# Altium schematic sheet STM32_AUX.SchDoc
size A4; SheetNumber: 8; SheetTotal: 10
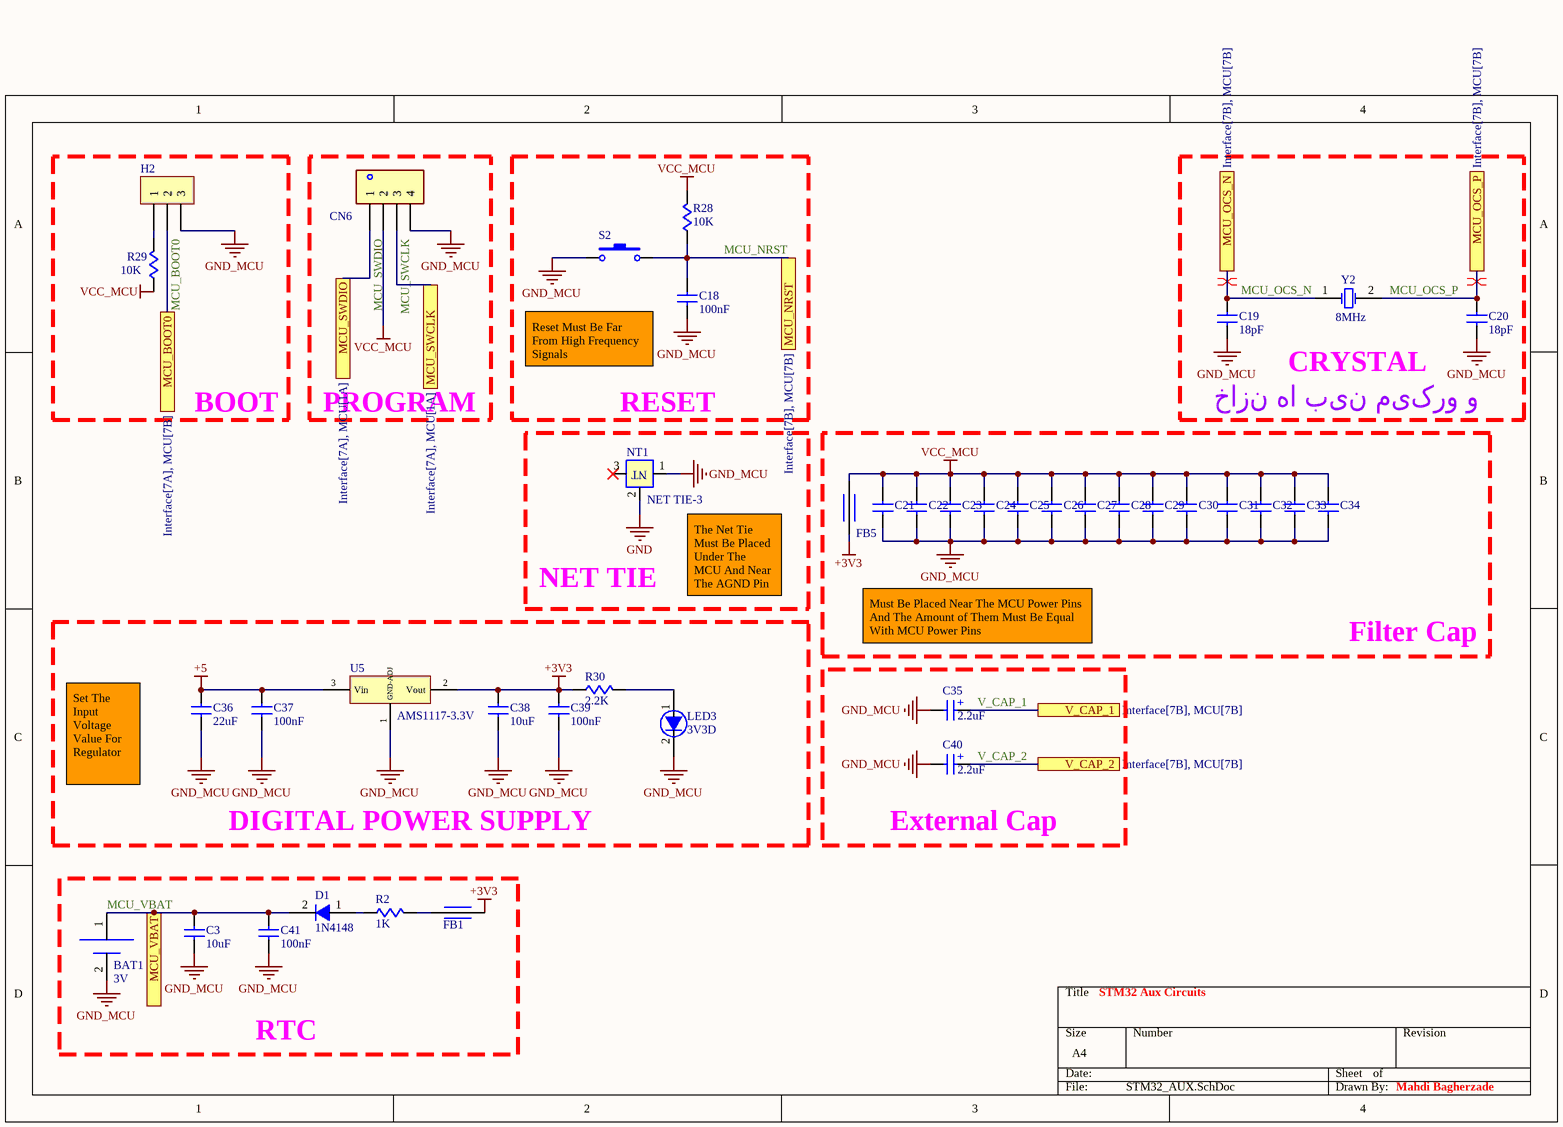
[diagram p0: STM32_AUX.SchDoc]

## Parts
BAT1  Voltage: 3V  [BAT-HOLDER-SMD-3V]  (hidden comment: Bat Holder 2016-SMD)
C3  value 10uF  [C-0805]  (hidden comment: CAP Cer 10uF-50V-X7R-SMD)
C18  value 100nF  [C-0805]  (hidden comment: CAP Cer 100nF-50V-X7R-SMD)
C19  value 18pF  [C-0805]  (hidden comment: CAP Cer 18pF-50V-X7R-SMD)
C20  value 18pF  [C-0805]  (hidden comment: CAP Cer 18pF-50V-X7R-SMD)
C21  CAP Cer 100nF-50V-X7R-SMD  [C-0805]  (value not drawn)
C22  CAP Cer 100nF-50V-X7R-SMD  [C-0805]  (value not drawn)
C23  CAP Cer 100nF-50V-X7R-SMD  [C-0805]  (value not drawn)
C24  CAP Cer 100nF-50V-X7R-SMD  [C-0805]  (value not drawn)
C25  CAP Cer 100nF-50V-X7R-SMD  [C-0805]  (value not drawn)
C26  CAP Cer 100nF-50V-X7R-SMD  [C-0805]  (value not drawn)
C27  CAP Cer 100nF-50V-X7R-SMD  [C-0805]  (value not drawn)
C28  CAP Cer 100nF-50V-X7R-SMD  [C-0805]  (value not drawn)
C29  CAP Cer 100nF-50V-X7R-SMD  [C-0805]  (value not drawn)
C30  CAP Cer 100nF-50V-X7R-SMD  [C-0805]  (value not drawn)
C31  CAP Cer 100nF-50V-X7R-SMD  [C-0805]  (value not drawn)
C32  CAP Cer 100nF-50V-X7R-SMD  [C-0805]  (value not drawn)
C33  CAP Cer 100nF-50V-X7R-SMD  [C-0805]  (value not drawn)
C34  CAP Cer 100nF-50V-X7R-SMD  [C-0805]  (value not drawn)
C35  value 2.2uF  [TAN-A]
C36  value 22uF  [C-0805]  (hidden comment: CAP Cer 22uF-50V-X7R-SMD)
C37  value 100nF  [C-0805]  (hidden comment: CAP Cer 100nF-50V-X7R-SMD)
C38  value 10uF  [C-0805]  (hidden comment: CAP Cer 10uF-50V-X7R-SMD)
C39  value 100nF  [C-0805]  (hidden comment: CAP Cer 100nF-50V-X7R-SMD)
C40  value 2.2uF  [TAN-A]
C41  value 100nF  [C-0805]  (hidden comment: CAP Cer 100nF-50V-X7R-SMD)
CN6  Connector XH/VH/TE-Straight/Right-THD/SMD-?mm  [XH-4]  (value not drawn)
D1  Code: 1N4148  [SOD80]  (hidden comment: Diode 1N4148-SMD)
FB1  Ferrite Bead SMD  [FB-0805]  (value not drawn)
FB5  FERRITE BEAD  [FB-0805]  (value not drawn)
H2  BOOT  [H-3pin-M-S]  (value not drawn)
LED3  3V3D  [LED-1206-R]
NT1  NET TIE-3  [NET TIE-3]  (net tie, no BOM)
R2  value 1K  [R-0805]  (hidden comment: RES 1K-5%-1/8W-SMD)
R28  value 10K  [R-0805]
R29  value 10K  [R-0805]
R30  value 2.2K  [R-0805]
S2  RESET  [SW-SMD-2pin-3x6]  (value not drawn)
U5  AMS1117-3.3V  [SOT223]
Y2  value 8MHz  [CRYSTAL-SMD]

## Blocks framed on the sheet
BOOT: H2 R29
PROGRAM: CN6
RESET: C18 R28 S2
CRYSTAL: C19 C20 Y2
Filter Cap: C21-C34 FB5
DIGITAL POWER SUPPLY: C36-C39 LED3 R30 U5
External Cap: C35 C40
RTC: BAT1 C3 C41 D1 FB1 R2

## Ports
MCU_BOOT0 (see Interface[7A], MCU[7B]), MCU_NRST (see Interface[7B], MCU[7B]), MCU_OCS_N (see Interface[7B], MCU[7B]), MCU_OCS_P (see Interface[7B], MCU[7B]), MCU_SWCLK (see Interface[7A], MCU[1A]), MCU_SWDIO (see Interface[7A], MCU[1A]), MCU_VBAT, V_CAP_1 (see Interface[7B], MCU[7B]), V_CAP_2 (see Interface[7B], MCU[7B])

## Nets
+3V3: C38.1 C39.1 FB1.1 FB5.1 R30.1 U5.2(Vout)
+5: C36.1 C37.1 U5.3(Vin)
GND: NT1.2
GND_MCU: BAT1.2(-) C3.1 C18.2 C19.2 C20.2 C21.2 C22.2 C23.2 C24.2 C25.2 C26.2 C27.2 C28.2 C29.2 C30.2 C31.2 C32.2 C33.2 C34.2 C35.2 C36.2 C37.2 C38.2 C39.2 C40.2 C41.1 CN6.4 H2.3 LED3.2(C) NT1.1 S2.1 U5.1(GND-ADJ)
VCC_MCU: C21.1 C22.1 C23.1 C24.1 C25.1 C26.1 C27.1 C28.1 C29.1 C30.1 C31.1 C32.1 C33.1 C34.1 CN6.2 FB5.2 R28.2 R29.1
MCU_BOOT0: H2.2 ; port MCU_BOOT0
MCU_NRST: C18.1 R28.1 S2.2 ; port MCU_NRST
MCU_OCS_N: C19.1 Y2.1(OSC1) ; port MCU_OCS_N
MCU_OCS_P: C20.1 Y2.2(OSC2) ; port MCU_OCS_P
MCU_SWCLK: CN6.3 ; port MCU_SWCLK
MCU_SWDIO: CN6.1 ; port MCU_SWDIO
MCU_VBAT: BAT1.1(+) C3.2 C41.2 D1.2(C) ; port MCU_VBAT
V_CAP_1: C35.1 ; port V_CAP_1
V_CAP_2: C40.1 ; port V_CAP_2
NetD1_1: D1.1(A) R2.1
NetFB1_2: FB1.2 R2.2
NetH2_1: H2.1 R29.2
NetLED3_1: LED3.1(A) R30.2

Not connected (* = marked no-connect by the designer): NT1 3*

## Layout directives
differential pair: MCU_OCS_N, MCU_OCS_P

## Notes on the sheet
- Reset Must Be Far From High Frequency Signals
- خازن ها بین میکرو و کریستال قرار بگیرند
- NET TIE
- The Net Tie Must Be Placed Under The MCU And Near The AGND Pin
- Must Be Placed Near The MCU Power Pins And The Amount of Them Must Be Equal With MCU Power Pins
- Set The Input Voltage Value For Regulator
- STM32 Aux Circuits
- Mahdi Bagherzade
- (in symbol CAP-TAN) +
- (in symbol NET TIE-3) NT

## Library data of the parts
BAT1 = BATTERY HOLDER: BATTERY; Phone Number: 0915 8700 314; Publisher: Mahdi Bagherzadeh; ComponentLink1Description: Linkedin; ComponentLink1URL: https://ir.linkedin.com/in/mahdi-bagherzade; Published Date: 9-15-2024; Size: 2016; Type: SMD
C3 C18-C20 C36-C39 C41 = CAP-CER: CAPACITOR; Phone Number: 0915 8700 314; Voltage: 50V; Tolerance: X7R; Type: SMD; Publisher: Mahdi Bagherzadeh; ComponentLink1Description: Linkedin; ComponentLink1URL: https://ir.linkedin.com/in/mahdi-bagherzade; Published Date: 9-15-2024
C21-C34 = CAP-CER: CAPACITOR; Phone Number: 0915 8700 314; Voltage: 50V; Tolerance: X7R; Type: SMD; Value: 100nF; Publisher: Mahdi Bagherzadeh; ComponentLink1Description: Linkedin; ComponentLink1URL: https://ir.linkedin.com/in/mahdi-bagherzade; Published Date: 9-15-2024
C35 C40 = CAP-TAN: CAPACITOR; Phone Number: 0915 8700 314; Voltage: 16V; Publisher: Mahdi Bagherzadeh; ComponentLink1Description: Linkedin; ComponentLink1URL: https://ir.linkedin.com/in/mahdi-bagherzade; Published Date: 9-15-2024; Power: -; Size: A; Tolerance: -
CN6 = CN-4pin: CONNECTOR; Phone Number: 0915 8700 314; Publisher: Mahdi Bagherzadeh; ComponentLink1Description: Linkedin; ComponentLink1URL: https://ir.linkedin.com/in/mahdi-bagherzade; Published Date: 9-15-2024; Size: ?mm; Type: Straight/Right-THD/SMD; Value: XH/VH/TE
D1 = DIODE: Phone Number: 0915 8700 314; Type: SMD; Publisher: Mahdi Bagherzadeh; ComponentLink1Description: Linkedin; ComponentLink1URL: https://ir.linkedin.com/in/mahdi-bagherzade; Published Date: 9-15-2024
FB1 FB5 = FERRITE BEAD: INDUCATOR; Phone Number: 0915 8700 314; Publisher: Mahdi Bagherzadeh; ComponentLink1Description: Linkedin; ComponentLink1URL: https://ir.linkedin.com/in/mahdi-bagherzade; Published Date: 9-15-2024
  FB1: Type: SMD
H2 = HEADER-3pin: HEADER; Phone Number: 0915 8700 314; Publisher: Mahdi Bagherzadeh; ComponentLink1Description: Linkedin; ComponentLink1URL: https://ir.linkedin.com/in/mahdi-bagherzade; Published Date: 9-15-2024; Type: MALE-STRAIGHT
LED3 = LED: Phone Number: 0915 8700 314; Color: RED; Publisher: Mahdi Bagherzadeh; ComponentLink1Description: Linkedin; ComponentLink1URL: https://ir.linkedin.com/in/mahdi-bagherzade; Published Date: 9-15-2024; Size: 0805
NT1 = NET TIE-3: Phone Number: 0915 8700 314; Publisher: Mahdi Bagherzadeh; ComponentLink1Description: Linkedin; ComponentLink1URL: https://ir.linkedin.com/in/mahdi-bagherzade; Published Date: 9-15-2024
R2 = RES: RESISTOR; Phone Number: 0915 8700 314; Tolerance: 5%; Power: 1/8W; Publisher: Mahdi Bagherzadeh; ComponentLink1Description: Linkedin; ComponentLink1URL: https://ir.linkedin.com/in/mahdi-bagherzade; Published Date: 9-15-2024; Type: SMD
R28-R30 = RES: RESISTOR; Phone Number: 0915 8700 314; Power: 1/8W; Tolerance: 5%; Publisher: Mahdi Bagherzadeh; ComponentLink1Description: Linkedin; ComponentLink1URL: https://ir.linkedin.com/in/mahdi-bagherzade; Published Date: 9-15-2024
S2 = PUSH BUTTON: SWITCH; Phone Number: 0915 8700 314; Publisher: Mahdi Bagherzadeh; ComponentLink1Description: Linkedin; ComponentLink1URL: https://ir.linkedin.com/in/mahdi-bagherzade; Published Date: 9-15-2024; Size: 3x6mm-2Pin
U5 = AMS1117: REGULATOR; Phone Number: 0915 8700 314; Voltage: ?V; Publisher: Mahdi Bagherzadeh; ComponentLink1Description: Linkedin; ComponentLink1URL: https://ir.linkedin.com/in/mahdi-bagherzade; Published Date: 9-15-2024
Y2 = CRYSTAL: Phone Number: 0915 8700 314; Publisher: Mahdi Bagherzadeh; ComponentLink1Description: Linkedin; ComponentLink1URL: https://ir.linkedin.com/in/mahdi-bagherzade; Published Date: 9-15-2024